# EAGLE design PCBDesign (EAGLE 9.6.2)
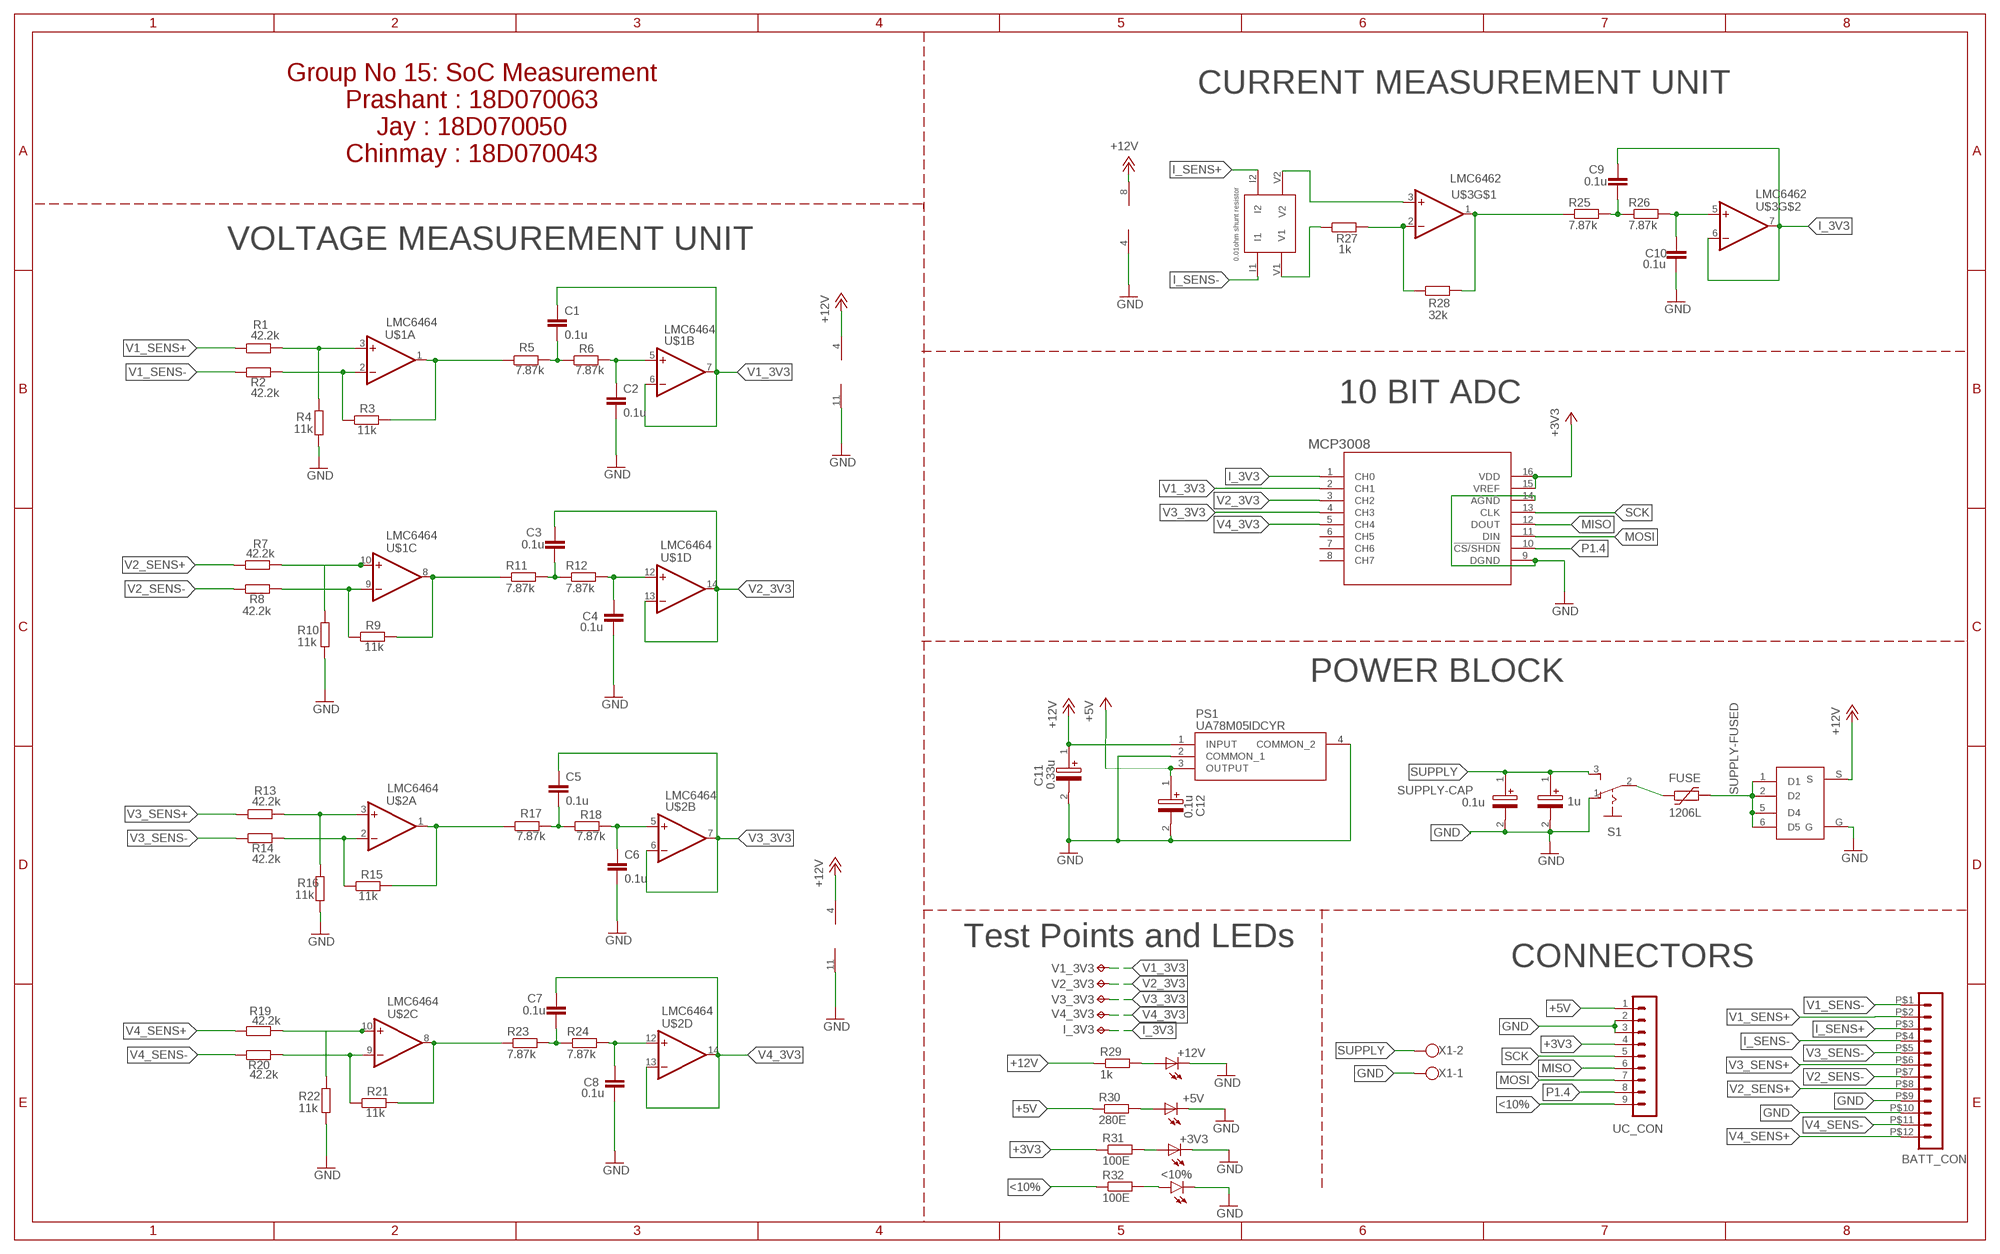
[diagram p0: schematic, sheet 1]

## Parts
+3V3  LED-FKIT-1206  [FKIT-LED-1206]
+5V  LED-FKIT-1206  [FKIT-LED-1206]
+12V  LED-FKIT-1206  [FKIT-LED-1206]
<10%  LED5MM  [LED5MM]
BATT_CON  HEADER_POS12_43045-1212  [43045-1212]
C1  0.1u  C-EUC0805  [C0805]
C2  0.1u  C-EUC0805  [C0805]
C3  0.1u  C-EUC0805  [C0805]
C4  0.1u  C-EUC0805  [C0805]
C5  0.1u  C-EUC0805  [C0805]
C6  0.1u  C-EUC0805  [C0805]
C7  0.1u  C-EUC0805  [C0805]
C8  0.1u  C-EUC0805  [C0805]
C9  0.1u  C-EUC0805  [C0805]
C10  0.1u  C-EUC0805  [C0805]
C11  0.33u  TAJR334K020RNJ  [CAPPM2014X120N]
C12  0.1u  TAJR334K020RNJ  [CAPPM2014X120N]
FUSE  1206L  [1206L]
I_3V3  TESTPADPAD1-13  [P1-13]
PS1  UA78M05IDCYR  [SOT230P700X180-4N]
R1  42.2k  R-EU_R0805  [R0805]
R2  42.2k  R-EU_R0805  [R0805]
R3  11k  R-EU_R0805  [R0805]
R4  11k  R-EU_R0805  [R0805]
R5  7.87k  R-EU_R0805  [R0805]
R6  7.87k  R-EU_R0805  [R0805]
R7  42.2k  R-EU_R0805  [R0805]
R8  42.2k  R-EU_R0805  [R0805]
R9  11k  R-EU_R0805  [R0805]
R10  11k  R-EU_R0805  [R0805]
R11  7.87k  R-EU_R0805  [R0805]
R12  7.87k  R-EU_R0805  [R0805]
R13  42.2k  R-EU_R0805  [R0805]
R14  42.2k  R-EU_R0805  [R0805]
R15  11k  R-EU_R0805  [R0805]
R16  11k  R-EU_R0805  [R0805]
R17  7.87k  R-EU_R0805  [R0805]
R18  7.87k  R-EU_R0805  [R0805]
R19  42.2k  R-EU_R0805  [R0805]
R20  42.2k  R-EU_R0805  [R0805]
R21  11k  R-EU_R0805  [R0805]
R22  11k  R-EU_R0805  [R0805]
R23  7.87k  R-EU_R0805  [R0805]
R24  7.87k  R-EU_R0805  [R0805]
R25  7.87k  R-EU_R0805  [R0805]
R26  7.87k  R-EU_R0805  [R0805]
R27  1k  R-EU_R0805  [R0805]
R28  32k  R-EU_R0805  [R0805]
R29  1k  R-EU_R0805  [R0805]
R30  280E  R-EU_R0805  [R0805]
R31  100E  R-EU_R0805  [R0805]
R32  100E  R-EU_R0805  [R0805]
S1  STS121PC04  [STS121PC04]
S2  DMP3125L/SQ3419AEEV  [DMP3125L/SQ3419AEEV]
SUPPLY-CAP  1u  TAJR334K020RNJ  [CAPPM2014X120N]
SUPPLY-CAP1  0.1u  TAJR334K020RNJ  [CAPPM2014X120N]
U1  MCP3008  MCP3008T-I/SLSOIC16-N_MC_MCH-L  [SOIC16-N_MC_MCH-L]
U$1  LMC6464  [SO14_LONGPADS]
U$2  LMC6464  [SO14_LONGPADS]
U$3  LMC6462  [S08]
U$4  0.01E  0.01OHM_SHUNT_RESISTOR  [SHNT_R_0.01]
UC_CON  MA09-1  [MA09-1]
V1_3V3  TESTPADPAD1-13  [P1-13]
V2_3V3  TESTPADPAD1-13  [P1-13]
V3_3V3  TESTPADPAD1-13  [P1-13]
V4_3V3  TESTPADPAD1-13  [P1-13]
X1  W237-102  [W237-102]

## Nets
+3V3: R31.1 U1.15(VREF) U1.16(VDD) UC_CON.4
+5V: C12.1(+) PS1.3(OUTPUT) R30.1 UC_CON.1
+12V: C11.1(+) PS1.1(INPUT) R29.1 S2.S U$1.4(POW:V+) U$2.4(POW:V+) U$3.8(V+)
<10%: R32.1 UC_CON.9
GND: +3V3.C +5V.C +12V.C <10%.K(C) BATT_CON.P$9 BATT_CON.P$10 C2.2 C4.2 C6.2 C8.2 C10.2 C11.2(-) C12.2(-) PS1.2(COMMON_1) PS1.4(COMMON_2) R4.2 R10.2 R16.2 R22.2 S1.1(O) S2.G SUPPLY-CAP1.2(-) SUPPLY-CAP.2(-) U1.9(DGND) U1.14(AGND) U$1.11(POW:V-) U$2.11(POW:V-) U$3.4(V-) UC_CON.2 UC_CON.3 X1.1
I_3V3: C9.1 I_3V3.TP U1.1(CH0) U$3.6(-IN) U$3.7(OUT)
I_SENS+: BATT_CON.P$3 U$4.I2
I_SENS-: BATT_CON.P$4 U$4.I1
MISO: U1.12(DOUT) UC_CON.6
MOSI: U1.11(DIN) UC_CON.7
N$1: C1.2 R5.2 R6.1
N$2: R1.2 R4.1 U$1.3(A:+IN)
N$3: R2.2 R3.1 U$1.2(A:-IN)
N$4: R3.2 R5.1 U$1.1(A:OUT)
N$5: FUSE.P$1 S1.2(P)
N$6: +5V.A R30.2
N$7: C2.1 R6.2 U$1.5(B:+IN)
N$8: +3V3.A R31.2
N$9: R7.2 R10.1 U$1.10(C:+IN)
N$10: R8.2 R9.1 U$1.9(C:-IN)
N$11: <10%.A R32.2
N$13: R9.2 R11.1 U$1.8(C:OUT)
N$14: C3.2 R11.2 R12.1
N$15: C5.2 R17.2 R18.1
N$16: C4.1 R12.2 U$1.12(D:+IN)
N$17: +12V.A R29.2
N$18: R13.2 R16.1 U$2.3(A:+IN)
N$19: R14.2 R15.1 U$2.2(A:-IN)
N$20: R15.2 R17.1 U$2.1(A:OUT)
N$23: C6.1 R18.2 U$2.5(B:+IN)
N$25: R19.2 R22.1 U$2.10(C:+IN)
N$26: R20.2 R21.1 U$2.9(C:-IN)
N$29: R21.2 R23.1 U$2.8(C:OUT)
N$30: C7.2 R23.2 R24.1
N$31: C8.1 R24.2 U$2.12(D:+IN)
N$33: R25.1 R28.2 U$3.1(OUT)
N$34: C9.2 R25.2 R26.1
N$35: C10.1 R26.2 U$3.5(+IN)
N$36: R27.2 R28.1 U$3.2(-IN)
N$38: U$3.3(+IN) U$4.V2
N$39: R27.1 U$4.V1
P1.4: U1.10(!CS/SHDN) UC_CON.8
SCK: U1.13(CLK) UC_CON.5
SUPPLY: S1.3(S) SUPPLY-CAP1.1(+) SUPPLY-CAP.1(+) X1.2
SUPPLY-FUSED: FUSE.P$2 S2.1(D1) S2.2(D2) S2.5(D4) S2.6(D5)
V1_3V3: C1.1 U1.2(CH1) U$1.6(B:-IN) U$1.7(B:OUT) V1_3V3.TP
V1_SENS+: BATT_CON.P$2 R1.1
V1_SENS-: BATT_CON.P$1 R2.1
V2_3V3: C3.1 U1.3(CH2) U$1.13(D:-IN) U$1.14(D:OUT) V2_3V3.TP
V2_SENS+: BATT_CON.P$8 R7.1
V2_SENS-: BATT_CON.P$7 R8.1
V3_3V3: C5.1 U1.4(CH3) U$2.6(B:-IN) U$2.7(B:OUT) V3_3V3.TP
V3_SENS+: BATT_CON.P$6 R13.1
V3_SENS-: BATT_CON.P$5 R14.1
V4_3V3: C7.1 U1.5(CH4) U$2.13(D:-IN) U$2.14(D:OUT) V4_3V3.TP
V4_SENS+: BATT_CON.P$12 R19.1
V4_SENS-: BATT_CON.P$11 R20.1
Unconnected: U1.6(CH5) U1.7(CH6) U1.8(CH7)

## Notes on the sheet
- CURRENT MEASUREMENT UNIT
- Group No 15: SoC Measurement
  Prashant : 18D070063
  Jay : 18D070050
  Chinmay : 18D070043
- 0.01ohm shunt resistor
- VOLTAGE MEASUREMENT UNIT
- 10 BIT ADC
- POWER BLOCK
- Test Points and LEDs
- CONNECTORS

## Library data of the parts
+3V3 +5V +12V = IIT_BOMBAY_Racing:LED: LEDs Standard schematic elements and footprints for 5mm, 3mm, 1206, and 0603 sized LEDs. 5mm - Spark Fun Electronics SKU : COM-00529 (and others)
<10% = led:LED: LED OSRAM: - CHIPLED LG R971, LG N971, LY N971, LG Q971, LY Q971, LO R971, LY R971 LH N974, LH R974 LS Q976, LO Q976, LY Q976 LO Q996 - Hyper CHIPLED LW Q18S LB Q993, LB Q99A, LB R99A - SideLED LS A670, LO A670, LY A670, LG A670, LP A670 LB A673, LV A673, LT A673, LW A673 LH A674 LY A675 LS A676, LA A676, LO A676, LY A676, LW A676 LS A679, LY A679, LG A679 - Hyper Micro SIDELED® LS Y876, LA Y876, LO Y876, LY Y876 LT Y87S - SmartLED LW L88C, LW L88S LB L89C, LB L89S, LG L890 LS L89K, LO L89K, LY L89K LS L896, LA L896, LO L896, LY L896 - TOPLED LS T670, LO T670, LY T670, LG T670, LP T670 LSG T670, LSP T670, LSY T670, LOP T670, LYG T670 LG T671, LOG T671, LSG T671 LB T673, LV T673, LT T673, LW T673 LH T674 LS T676, LA T676, LO T676, LY T676, LB T676, LH T676, LSB T676, LW T676 LB T67C, LV T67C, LT T67C, LS T67K, LO T67K, LY T67K, LW E67C LS E67B, LA E67B, LO E67B, LY E67B, LB E67C, LV E67C, LT E67C LW T67C LS T679, LY T679, LG T679 LS T770, LO T770, LY T770, LG T770, LP T770 LB T773, LV T773, LT T773, LW T773 LH T774 LS E675, LA E675, LY E675, LS T675 LS T776, LA T776, LO T776, LY T776, LB T776 LHGB T686 LT T68C, LB T68C - Hyper Mini TOPLED® LB M676 - Mini TOPLED Santana® LG M470 LS M47K, LO M47K, LY M47K Source: http://www.osram.convergy.de LUXEON: - LUMILED® LXK2-PW12-R00, LXK2-PW12-S00, LXK2-PW14-U00, LXK2-PW14-V00 LXK2-PM12-R00, LXK2-PM12-S00, LXK2-PM14-U00 LXK2-PE12-Q00, LXK2-PE12-R00, LXK2-PE12-S00, LXK2-PE14-T00, LXK2-PE14-U00 LXK2-PB12-K00, LXK2-PB12-L00, LXK2-PB12-M00, LXK2-PB14-N00, LXK2-PB14-P00, LXK2-PB14-Q00 LXK2-PR12-L00, LXK2-PR12-M00, LXK2-PR14-Q00, LXK2-PR14-R00 LXK2-PD12-Q00, LXK2-PD12-R00, LXK2-PD12-S00 LXK2-PH12-R00, LXK2-PH12-S00 LXK2-PL12-P00, LXK2-PL12-Q00, LXK2-PL12-R00 Source: www.luxeon.com KINGBRIGHT: KA-3528ASYC Source: www.kingbright.com
BATT_CON = IIT_BOMBAY_Racing:HEADER_POS12_?: Molex - Micro-Fit 3.0 Series connector, 3.00mm (0.118") pitch header, 12 positions.
C1-C10 = IIT_BOMBAY_Racing2:C-EU: CAPACITOR, European symbol
C11 C12 SUPPLY-CAP SUPPLY-CAP1 = SamacSys_Parts:TAJR334K020RNJ: TAJ smt tant capacitor,case R,0.33uF,20V AVX 330nF SMD Solid MnO2 Tantalum Electrolytic Capacitor, 20 V dc +/-10%, TAJ Series Source: Datasheet <https://componentsearchengine.com/Datasheets/1/TAJR334K020RNJ.pdf>; DESCRIPTION: TAJ smt tant capacitor,case R,0.33uF,20V AVX 330nF SMD Solid MnO2 Tantalum Electrolytic Capacitor, 20 V dc +/-10%, TAJ Series; HEIGHT: 1.2mm; MANUFACTURER_NAME: AVX; MANUFACTURER_PART_NUMBER: TAJR334K020RNJ; MOUSER_PART_NUMBER: 581-TAJR334K020R; MOUSER_PRICE-STOCK: https://www.mouser.com/Search/Refine.aspx?Keyword=581-TAJR334K020R
FUSE = fuse_1206L:1206L; MFR: Littelfuse; MFR_ID: 1206L175SLYR; PRODUCT_ID: 576-1206L175SLYR
I_3V3 V1_3V3 V2_3V3 V3_3V3 V4_3V3 = IIT_BOMBAY_Racing:TESTPAD: Test pad
PS1 = SamacSys_Parts:UA78M05IDCYR: 500-mA, 25-V, Linear Voltage Regulators Source: Datasheet <http://www.ti.com/lit/gpn/ua78m>; DESCRIPTION: 500-mA, 25-V, Linear Voltage Regulators; HEIGHT: 1.8mm; MANUFACTURER_NAME: Texas Instruments; MANUFACTURER_PART_NUMBER: UA78M05IDCYR; MOUSER_PART_NUMBER: 595-UA78M05IDCYR; MOUSER_PRICE-STOCK: https://www.mouser.co.uk/ProductDetail/Texas-Instruments/UA78M05IDCYR?qs=0O%2FZFlpUpJXf0Y5v1qo1ow%3D%3D
R1-R28 = IIT_BOMBAY_Racing2:R-EU_: RESISTOR, European symbol
R29-R32 = IIT_BOMBAY_Racing:R-EU_: RESISTOR, European symbol
S1 = switches:STS121PC04: SLIDING SWITCH Distributor Buerklin, 11G810
S2 = SQ3419Pmosbig:DMP3125L/SQ3419AEEV
U1 = MCP3008:MCP3008T-I/SL; BUILT_BY: EMA_Jessica; COPYRIGHT: Copyright (C) 2018 Accelerated Designs. All rights reserved; MANUFACTURER_PART_NUMBER: MCP3008T-I/SL; SOURCELIBRARY: Microchip_2019-08-23_5; VENDOR: Microchip
U$1 U$2 = IIT_BOMBAY_Racing2:LMC6464
U$3 = IIT_BOMBAY_Racing2:LMC6462
U$4 = 0.01ohm_Shunt_Resistor:0.01OHM_SHUNT_RESISTOR
UC_CON = con-lstb:MA09-1: PIN HEADER; OC_FARNELL: unknown; OC_NEWARK: unknown
X1 = con-wago-500:W237-102: WAGO SCREW CLAMP; MPN: 237-102; OC_FARNELL: unknown; OC_NEWARK: 70K9898

## Board
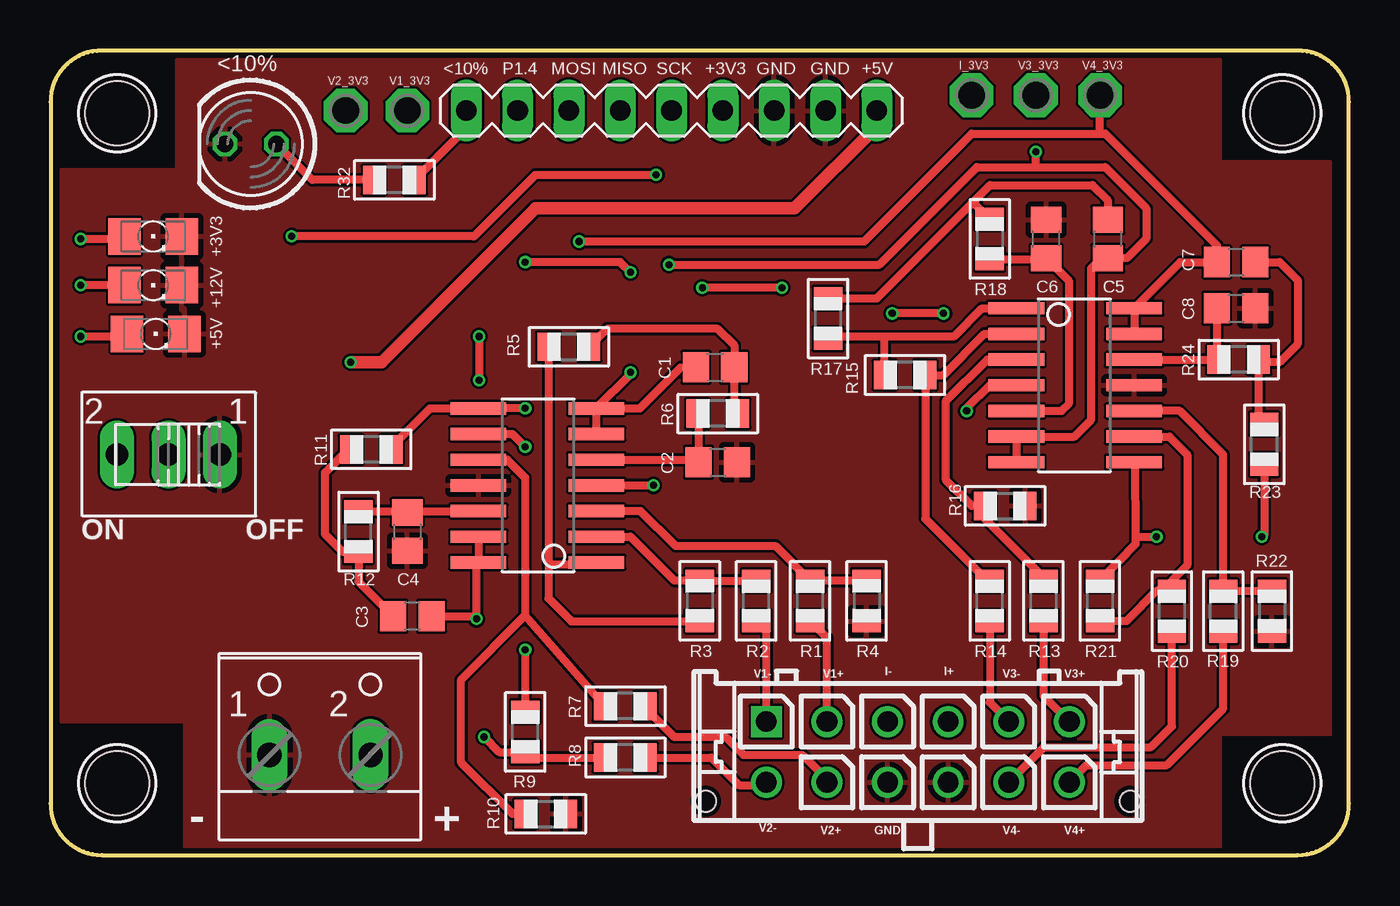
[diagram p1: board, top side]
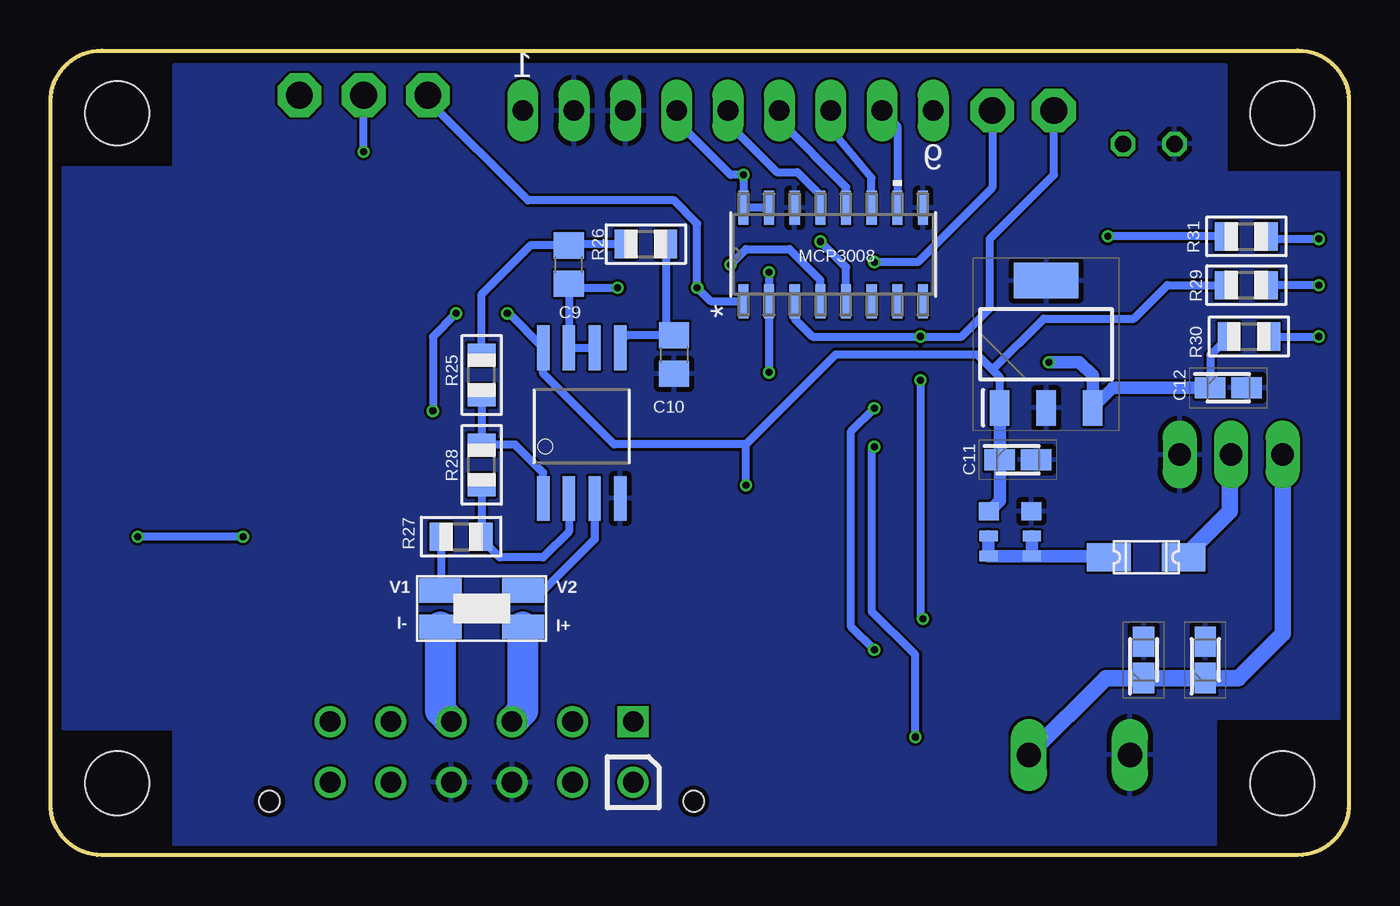
[diagram p2: board, bottom side, seen from below]

Size 64.26 x 39.8 mm. Coordinates in mm from the lower left corner, seen from the top.
Outline: 0,37.26 0,2.54 arc90 2.54,0 61.72,0 arc90 64.26,2.54 64.26,37.26 arc90 61.72,39.8 2.54,39.8 arc90 0,37.26
Copper layers (1*16): Top 0.035mm / dielectric 1.5mm / Bottom 0.035mm
Design rules "PCB_Power": minimum track width 5mil, minimum drill 10mil, track to track 5mil, track to pad 5mil, pad to pad 5mil, via to via 5mil, smd to smd 5mil, copper to edge 10mil, drill to drill 6mil, minimum pad ring 5mil, minimum via ring 5mil, stop-mask expansion 3mil, vias tented up to drill 0mil, thermal gap 10mil
Holes 3.17 mm at 3.3,3.56 60.96,3.56 3.3,36.7 60.96,36.7

### Footprints (pad centres in the part's own frame; a part is rotated, then mirrored left to right if it is on the bottom)
FKIT-LED-1206 = smd 1.6 x 1.803: A -1.422,0; C 1.422,0
LED5MM = drill 0.813 octagon: A -1.27,0; K 1.27,0
43045-1212 = drill 1.02 square: P$1 7.5,0 | drill 1.02: P$2 4.5,0; P$3 1.5,0; P$4 -1.5,0; P$5 -4.5,0; P$6 -7.5,0; P$7 7.5,3; P$8 4.5,3; P$9 1.5,3; P$10 -1.5,3; P$11 -4.5,3; P$12 -7.5,3 | hole 1.02: 10.5,3.94; -10.5,3.94
C0805 = smd 1.3 x 1.5: 1 -0.95,0; 2 0.95,0
CAPPM2014X120N = smd 1.5 x 1.05: 1 -0.9,0; 2 0.9,0
1206L = smd 2.16 x 1.4: P$1 -1.85,0; P$2 1.85,0
P1-13 = drill 1.321 pad 2.159 octagon: TP 0,0
SOT230P700X180-4N = smd 1.75 x 0.95: 1 -3.15,2.3; 2 -3.15,0; 3 -3.15,-2.3 | smd 1.75 x 3.2: 4 3.15,0
R0805 = smd 1.1 x 1.4: 1 -1,0; 2 1,0
STS121PC04 = drill 1.118 long: 1 -3.81,0; 2 -1.27,0; 3 1.29,0
DMP3125L/SQ3419AEEV = smd 0.51 x 0.9: 1 -1.595,-1.07; 2 -0.6,-1.07; 5 -0.6,1.07; 6 -1.595,1.07 | smd 0.9 x 1: G 0.62,-1.05; S 0.62,1.05
SOIC16-N_MC_MCH-L = smd 1.676 x 0.508: 1 -2.311,4.445; 2 -2.311,3.175; 3 -2.311,1.905; 4 -2.311,0.635; 5 -2.311,-0.635; 6 -2.311,-1.905; 7 -2.311,-3.175; 8 -2.311,-4.445; 9 2.311,-4.445; 10 2.311,-3.175; 11 2.311,-1.905; 12 2.311,-0.635; 13 2.311,0.635; 14 2.311,1.905; 15 2.311,3.175; 16 2.311,4.445
SO14_LONGPADS = smd 0.61 x 2.762: 1 -6.35,-1.61; 2 -5.08,-1.61; 3 -3.81,-1.61; 4 -2.54,-1.61; 5 -1.27,-1.61; 6 0,-1.61; 7 1.27,-1.61; 8 1.27,4.226; 9 0,4.226; 10 -1.27,4.226; 11 -2.54,4.226; 12 -3.81,4.226; 13 -5.08,4.226; 14 -6.35,4.226
S08 = smd 0.61 x 2.21: 1 -1.905,-3.569; 2 -0.635,-3.569; 3 0.635,-3.569; 4 1.905,-3.569; 5 1.905,3.886; 6 0.635,3.886; 7 -0.635,3.886; 8 -1.905,3.886
SHNT_R_0.01 = smd 2.1 x 1.2: I1 -2.05,-0.9; I2 2.05,-0.9; V1 -2.05,0.9; V2 2.05,0.9
MA09-1 = drill 1.016 long: 1 -10.16,0; 2 -7.62,0; 3 -5.08,0; 4 -2.54,0; 5 0,0; 6 2.54,0; 7 5.08,0; 8 7.62,0; 9 10.16,0
W237-102 = drill 1.194 long: 1 -2.5,-1.27; 2 2.5,-1.27

### Placement (x,y rotation side)
+3V3  5.08,30.61 0 top
+5V  5.21,25.78 0 top
+12V  5.08,28.19 0 top
<10%  9.91,35.18 180 top
BATT_CON  42.93,6.6 180 top
C1  32.89,24.13 0 top
C2  33.02,19.43 0 top
C3  17.91,11.81 180 top
C4  17.65,16 270 top
C5  52.32,30.48 90 top
C6  49.28,30.48 90 top
C7  58.67,29.34 0 top
C8  58.67,27.05 0 top
C9  38.61,29.21 90 bottom
C10  33.4,24.77 270 bottom
C11  16.38,19.56 0 bottom
C12  5.97,23.11 0 bottom
FUSE  10.03,14.73 180 bottom
I_3V3  45.59,37.59 0 top
PS1  14.99,25.27 90 bottom
R1  37.59,12.57 90 top
R2  34.92,12.57 90 top
R3  32.13,12.57 270 top
R4  40.39,12.57 270 top
R5  25.65,25.15 0 top
R6  33.02,21.84 180 top
R7  28.45,7.37 180 top
R8  28.45,4.83 180 top
R9  23.5,6.1 90 top
R10  24.51,2.03 0 top
R11  15.88,20.07 180 top
R12  15.24,16 90 top
R13  49.15,12.57 90 top
R14  46.48,12.57 90 top
R15  42.29,23.75 180 top
R16  47.24,17.27 0 top
R17  38.48,26.54 90 top
R18  46.48,30.48 270 top
R19  58.04,12.06 90 top
R20  55.5,12.06 90 top
R21  51.94,12.57 90 top
R22  60.45,12.06 270 top
R23  60.07,20.32 90 top
R24  58.8,24.51 180 top
R25  42.93,23.75 90 bottom
R26  34.8,30.23 0 bottom
R27  43.94,15.75 0 bottom
R28  42.93,19.3 90 bottom
R29  5.08,28.19 0 bottom
R30  4.95,25.65 0 bottom
R31  5.08,30.61 0 bottom
R32  17.02,33.4 180 top
S1  4.57,19.81 180 top
S2  16.76,16.38 90 bottom
SUPPLY-CAP  10.16,9.65 90 bottom
SUPPLY-CAP1  7.11,9.65 90 bottom
U1  25.53,29.72 90 bottom
U$1  25.4,20.83 90 top
U$2  49.4,20.7 270 top
U$3  37.97,21.21 0 bottom
U$4  42.93,12.19 0 bottom
UC_CON  30.73,36.83 180 top
V1_3V3  17.65,36.83 0 top
V2_3V3  14.61,36.83 0 top
V3_3V3  48.77,37.59 0 top
V4_3V3  51.94,37.59 0 top
X1  13.34,6.22 0 top

### Tracks (layer width: path | path; a pad name or v marks a point on that pad's centre or on a via)
+3V3  (via drill 0.35)
  Top 0.406: v29.97,33.65 24,33.65 20.95,30.61 v11.94,30.61
  Bottom 0.406: U1.15 U1.16 v29.97,33.65 30.61,33.65 33.27,36.32 UC_CON.4 | R31.1 v11.94,30.61
+5V  (via drill 0.35)
  Top 0.61: v14.86,24.38 16.38,24.38 24,32 36.83,32 40.89,36.07 UC_CON.1
  Bottom 0.406: R30.1 6.87,24.74 C12.1
  Bottom 0.61: C12.1 11.7,23.11 PS1.3 12.69,23.73 13.34,24.38 v14.86,24.38
+12V  (via drill 0.35)
  Top 0.406: U$2.4 46.48,23.24 45.34,22.1 v45.34,21.97 | v44.2,26.8 v41.66,26.8 | U$1.4 v29.84,18.29
  Bottom 0.406: PS1.1 17.29,23.65 17.64,24 | 17.64,24 18.4,24.77 25.4,24.77 29.84,20.32 | v41.66,26.8 41.58,26.8 U$3.8 39.88,23.83 36.37,20.32 29.84,20.32 | v44.2,26.8 45.34,25.65 v45.34,21.97 | 17.64,24 15.1,26.54 10.65,26.54 9,28.19 R29.1 | v29.84,18.29 29.84,20.32
  Bottom 0.61: S2.S 17.28,17.53 C11.1 PS1.1
<10%
  Top 0.406: UC_CON.9 20.57,35.96 R32.1
GND
  pour Bottom: 6.6,0.51 58.17,0.51 58.17,6.22 63.63,6.22 63.63,34.04 58.17,34.04 58.17,39.12 6.1,39.12 6.1,33.78 0.51,33.78 0.51,6.73 6.6,6.73
  pour Top: 6.6,0.38 57.91,0.38 57.91,5.97 63.37,5.97 63.37,34.29 57.91,34.29 57.91,39.37 6.22,39.37 6.22,33.91 0.51,33.91 0.51,6.6 6.6,6.6
I_3V3  (via drill 0.35)
  Top 0.406: v36.2,28.07 v32.26,28.07
  Bottom 0.406: U$3.6 U$3.7 C9.1 38.6,28.07 v36.2,28.07 | U1.1 31.6,27.41 v32.26,28.07 32.26,31.24 33.4,32.38 40.64,32.38 45.59,37.34 I_3V3.TP
I_SENS+
  Bottom 1.524: BATT_CON.P$3 40.88,7.15 U$4.I2
I_SENS-
  Bottom 1.524: U$4.I1 44.98,7.15 BATT_CON.P$4
MISO
  Bottom 0.406: UC_CON.6 28.19,36.35 24.89,33.04 U1.12
MOSI
  Bottom 0.406: UC_CON.7 25.65,35.94 23.62,33.5 U1.11
N$1
  Top 0.406: R5.2 27.54,26.04 33.02,26.04 33.84,25.21 C1.2 33.84,22.02 R6.1
N$2
  Top 0.406: R4.1 R1.2 35.87,15.29 30.93,15.29 29.21,17.02 U$1.3
N$3
  Top 0.406: U$1.2 28.7,15.75 30.88,13.57 R3.1 R2.2
N$4
  Top 0.406: U$1.1 26.92,14.39 24.74,14.39 24.64,14.49 | R5.1 24.64,14.49 | 24.64,14.49 24.64,12.7 25.78,11.56 32.12,11.56 R3.2
N$5
  Bottom 0.813: S1.2 5.9,19.76 5.9,17.02 FUSE.P$1
N$6  (via drill 0.35)
  Top 0.406: +5V.A 3.66,25.65 v1.5,25.65
  Bottom 0.406: R30.2 v1.5,25.65
N$7
  Top 0.406: R6.2 32.07,21.79 32.07,19.56 | 32.07,19.56 C2.1 | U$1.5 32.07,19.56
N$8  (via drill 0.35)
  Top 0.406: v1.5,30.48 3.53,30.48 +3V3.A
  Bottom 0.406: R31.2 3.95,30.48 v1.5,30.48
N$9
  Top 0.406: R7.2 23.5,11.85 | U$1.10 22.61,19.56 23.5,18.67 23.5,11.85 | R10.1 22.86,2.03 20.32,4.57 20.32,8.68 23.5,11.85
N$10  (via drill 0.35)
  Top 0.406: v23.5,20.19 22.86,20.83 U$1.9 | v21.46,5.84 22.21,5.1 R9.1 23.77,4.83 R8.2
  Bottom 0.406: v21.46,5.84 21.46,9.91 23.62,12.06 23.62,20.07 v23.5,20.19
N$11
  Top 0.406: R32.2 12.95,33.4 <10%.A
N$13  (via drill 0.35)
  Top 0.406: v23.5,10.16 R9.2 | v23.5,22.1 U$1.8 18.78,22.1 16.88,20.19 R11.1
  Bottom 0.406: v23.5,10.16 24.64,11.3 24.64,20.96 v23.5,22.1
N$14
  Top 0.406: C3.2 15.24,13.53 R12.1 14.46,15 13.59,15.87 13.59,18.92 14.73,20.07 R11.2
N$15
  Top 0.406: C5.2 52.32,32.38 51.56,33.15 46.5,33.15 45.66,32.3 | 45.66,32.3 40.89,27.54 R17.2 | R18.1 45.66,32.3
N$16
  Top 0.406: U$1.12 17.72,17.02 C4.1 17.6,17 R12.2
N$17  (via drill 0.35)
  Top 0.406: +12V.A v1.5,28.19
  Bottom 0.406: v1.5,28.19 R29.2
N$18
  Top 0.406: R13.2 49.15,13.73 46.24,16.64 R16.1 45.59,17.27 44.32,18.54 44.32,22.48 46.35,24.51 U$2.3
N$19
  Top 0.406: R14.2 46.35,13.57 43.29,16.64 R15.1 44.2,23.75 46.23,25.78 U$2.2
N$20
  Top 0.406: U$2.1 46.1,27.05 44.7,25.65 41.27,25.65 | 41.27,25.65 38.59,25.65 R17.1 | R15.2 41.27,23.77 41.27,25.65
N$23
  Top 0.406: U$2.5 50.04,21.97 50.42,22.35 50.42,28.39 49.33,29.48 | 49.33,29.48 C6.1 | R18.2 49.33,29.48
N$25
  Top 0.406: U$2.10 55.88,21.97 58.04,19.81 R19.2 R22.1
N$26
  Top 0.406: U$2.9 55.37,20.7 56.26,19.81 56.26,14.33 55.5,13.57 R20.2 54.74,13.06 53.24,11.57 R21.1
N$29  (via drill 0.35)
  Top 0.406: U$2.8 53.69,19.37 53.72,15.75 | R21.2 53.7,15.39 53.7,15.75 53.72,15.75 | 53.72,15.75 v54.74,15.75 | R23.1 60.07,15.87 v59.94,15.75
  Bottom 0.406: v54.74,15.75 v59.94,15.75
N$30
  Top 0.406: R23.2 59.8,21.59 R24.1 59.93,24.38 60.83,24.38 61.72,25.27 61.72,28.45 60.83,29.34 C7.2
N$31
  Top 0.406: U$2.12 R24.2 57.72,24.59 C8.1
N$33
  Bottom 0.406: U$3.1 39.88,18.92 41.26,20.3 R28.2 R25.1
N$34
  Bottom 0.406: R26.1 38.1,30.23 38.17,30.16 C9.2 40.51,30.16 42.93,27.75 R25.2
N$35
  Bottom 0.406: U$3.5 36.07,25.4 35.75,25.71 C10.1 33.8,26.11 R26.2
N$36
  Bottom 0.406: U$3.2 38.61,16 39.88,14.73 42.04,14.73 42.86,15.56 42.93,15.62 | 42.93,15.62 42.94,15.64 R27.2 | R28.1 42.93,15.62
N$38
  Bottom 0.406: U$3.3 37.34,15.62 40.01,12.95 40.74,12.95 U$4.V2
N$39
  Bottom 0.406: R27.1 44.94,13.13 U$4.V1
P1.4
  Bottom 0.406: UC_CON.8 22.35,36.07 U1.10
SCK
  Bottom 0.406: UC_CON.5 30.73,36.2 28.32,33.78 27.3,33.78 26.16,32.64 U1.13
SUPPLY
  Bottom 0.813: X1.2 12.04,8.75 SUPPLY-CAP.1 SUPPLY-CAP1.1 5.47,8.75 3.28,10.94 S1.3
SUPPLY-FUSED
  Bottom 0.61: S2.1 11.94,14.79 FUSE.P$2 | S2.1 S2.2 | S2.1 S2.6 S2.5
V1_3V3  (via drill 0.35)
  Top 0.406: U$1.7 U$1.6 | U$1.7 29.17,22.1 31.2,24.13 C1.1 | v28.7,23.88 28.7,23.79 U$1.7 | v28.7,28.83 28.19,29.34 v23.5,29.34
  Bottom 0.406: v28.7,23.88 U1.2 v28.7,28.83 | V1_3V3.TP 17.65,33.02 21.34,29.34 v23.5,29.34
V1_SENS+
  Top 0.406: BATT_CON.P$2 38.43,10.74 R1.1
V1_SENS-
  Top 0.406: BATT_CON.P$1 35.43,11.07 R2.1
V2_3V3  (via drill 0.35)
  Top 0.406: U$1.13 U$1.14 21.08,14.39 v21.08,11.68 20.95,11.81 C3.1 | v21.21,25.65 v21.21,23.5
  Bottom 0.406: U1.3 27.43,26.54 26.54,25.65 v21.21,25.65 19.18,25.65 17.78,27.05 17.78,30.48 14.61,33.65 V2_3V3.TP | v21.21,23.5 21.21,11.81 v21.08,11.68
V2_SENS+
  Top 0.406: R7.1 29.45,7.25 30.86,5.84 33.4,5.84 34.29,4.95 37.21,4.95 38.43,3.74 BATT_CON.P$8
V2_SENS-
  Top 0.406: R8.1 32.71,4.83 34.07,3.46 35.29,3.46 BATT_CON.P$7
V3_3V3  (via drill 0.35)
  Top 0.406: U$2.7 U$2.6 50.67,20.7 51.51,21.54 51.51,29.03 52.01,29.53 C5.1 53.28,29.53 54.23,30.48 54.23,32 52.2,34.04 48.77,34.04 | v30.61,29.21 41.02,29.21 45.85,34.04 48.77,34.04 | 48.77,34.04 v48.77,34.8
  Bottom 0.406: U1.4 26.16,28.45 27.69,29.97 29.84,29.97 v30.61,29.21 | v48.77,34.8 V3_3V3.TP
V3_SENS+
  Top 0.406: R13.1 49.15,7.88 BATT_CON.P$6
V3_SENS-
  Top 0.406: R14.1 46.48,7.55 BATT_CON.P$5
V4_3V3  (via drill 0.35)
  Top 0.406: U$2.13 U$2.14 55.91,29.34 C7.1 57.72,30.16 52.2,35.69 51.94,35.69 | 51.94,35.69 45.59,35.69 40.26,30.35 v26.16,30.35 | 51.94,35.69 V4_3V3.TP
  Bottom 0.406: U1.5 24.89,29.08 v26.16,30.35
V4_SENS+
  Top 0.406: BATT_CON.P$12 51.27,4.45 55.24,4.45 58.04,7.24 R19.1
V4_SENS-
  Top 0.406: BATT_CON.P$11 49.16,5.33 54.47,5.33 55.5,6.37 R20.1

### Text on the board
tPlace: P1.4 | MOSI | MISO | SCK | +3V3 | GND | GND | +5V | ON | OFF | V1- | V1+ | I- | I+ | V3- | V3+ | - | + | V2- | V2+ | GND | V4- | V4+
bPlace: V2 | V1 | I+ | I-
tNames: <10%